# Altium schematic sheet lower-pcb.SchDoc
size A; SheetNumber: 1; SheetTotal: 1
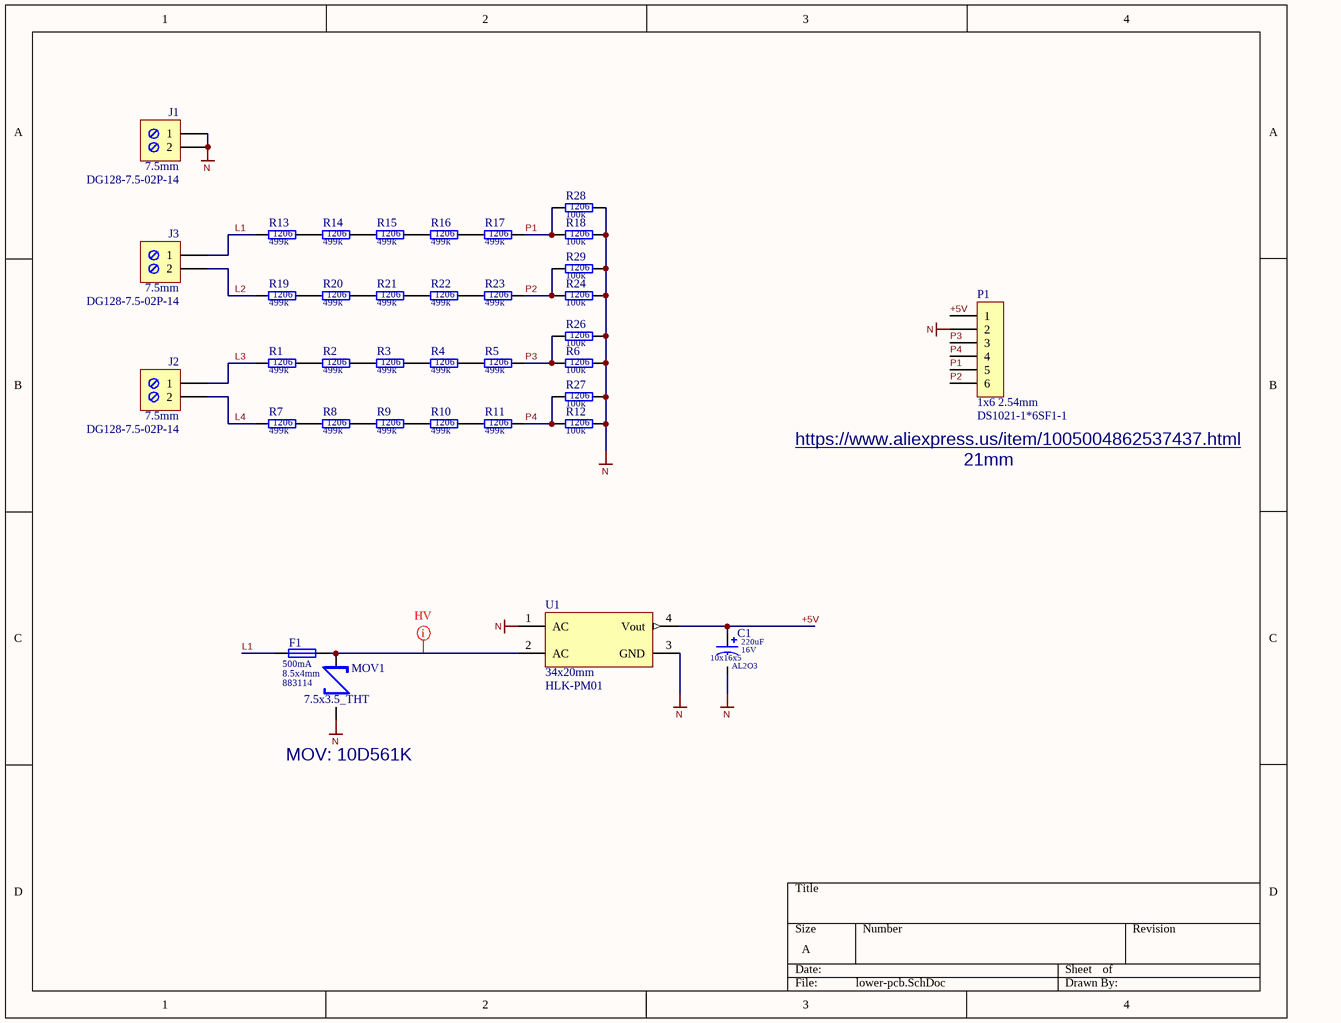
[diagram p0: lower-pcb.SchDoc]

## Parts
C1  value 220uF  Dielectric: AL2O3  SCH_Footprint: 10x16x5  Voltage: 16V  [CE_D_10x16x5_THT]  (hidden comment: Electrolytic Capacitor)
F1  value 883114  SCH_Footprint: 8.5x4mm  Current: 500mA  [F_TE5_8.5x4]  (hidden comment: Fuse)
J1  value DG128-7.5-02P-14  SCH_Footprint: 7.5mm  [DG128-7.5-02P-14]  (hidden comment: Terminal Blocks 2P 7.5mm)
J2  value DG128-7.5-02P-14  SCH_Footprint: 7.5mm  [DG128-7.5-02P-14]  (hidden comment: Terminal Blocks 2P 7.5mm)
J3  value DG128-7.5-02P-14  SCH_Footprint: 7.5mm  [DG128-7.5-02P-14]  (hidden comment: Terminal Blocks 2P 7.5mm)
MOV1  MOV  [MOV_AXIAL_7.5_3.5]  (value not drawn)
P1  value DS1021-1*6SF1-1  SCH_Footprint: 1x6 2.54mm  [P_HEADER_1x6_2.54]  (hidden comment: Goldpin)
R1  value 499k  SCH_Footprint: 1206  [R_1206_3216]  (hidden comment: Resistor)
R2  value 499k  SCH_Footprint: 1206  [R_1206_3216]  (hidden comment: Resistor)
R3  value 499k  SCH_Footprint: 1206  [R_1206_3216]  (hidden comment: Resistor)
R4  value 499k  SCH_Footprint: 1206  [R_1206_3216]  (hidden comment: Resistor)
R5  value 499k  SCH_Footprint: 1206  [R_1206_3216]  (hidden comment: Resistor)
R6  value 100k  SCH_Footprint: 1206  [R_1206_3216]  (hidden comment: Resistor)
R7  value 499k  SCH_Footprint: 1206  [R_1206_3216]  (hidden comment: Resistor)
R8  value 499k  SCH_Footprint: 1206  [R_1206_3216]  (hidden comment: Resistor)
R9  value 499k  SCH_Footprint: 1206  [R_1206_3216]  (hidden comment: Resistor)
R10  value 499k  SCH_Footprint: 1206  [R_1206_3216]  (hidden comment: Resistor)
R11  value 499k  SCH_Footprint: 1206  [R_1206_3216]  (hidden comment: Resistor)
R12  value 100k  SCH_Footprint: 1206  [R_1206_3216]  (hidden comment: Resistor)
R13  value 499k  SCH_Footprint: 1206  [R_1206_3216]  (hidden comment: Resistor)
R14  value 499k  SCH_Footprint: 1206  [R_1206_3216]  (hidden comment: Resistor)
R15  value 499k  SCH_Footprint: 1206  [R_1206_3216]  (hidden comment: Resistor)
R16  value 499k  SCH_Footprint: 1206  [R_1206_3216]  (hidden comment: Resistor)
R17  value 499k  SCH_Footprint: 1206  [R_1206_3216]  (hidden comment: Resistor)
R18  value 100k  SCH_Footprint: 1206  [R_1206_3216]  (hidden comment: Resistor)
R19  value 499k  SCH_Footprint: 1206  [R_1206_3216]  (hidden comment: Resistor)
R20  value 499k  SCH_Footprint: 1206  [R_1206_3216]  (hidden comment: Resistor)
R21  value 499k  SCH_Footprint: 1206  [R_1206_3216]  (hidden comment: Resistor)
R22  value 499k  SCH_Footprint: 1206  [R_1206_3216]  (hidden comment: Resistor)
R23  value 499k  SCH_Footprint: 1206  [R_1206_3216]  (hidden comment: Resistor)
R24  value 100k  SCH_Footprint: 1206  [R_1206_3216]  (hidden comment: Resistor)
R26  value 100k  SCH_Footprint: 1206  [R_1206_3216]  (hidden comment: Resistor)
R27  value 100k  SCH_Footprint: 1206  [R_1206_3216]  (hidden comment: Resistor)
R28  value 100k  SCH_Footprint: 1206  [R_1206_3216]  (hidden comment: Resistor)
R29  value 100k  SCH_Footprint: 1206  [R_1206_3216]  (hidden comment: Resistor)
U1  value HLK-PM01  SCH_Footprint: 34x20mm  [VS_HLK-PMxx]  (hidden comment: 5V Mains power supply)

## Nets
N: C1.2 J1.1 J1.2 MOV1.1 P1.2 R6.2 R12.2 R18.2 R24.2 R26.2 R27.2 R28.2 R29.2 U1.1(AC) U1.3(GND)
+5V: C1.1 P1.1 U1.4(Vout)
L1: F1.1 J3.1 R13.1
L2: J3.2 R19.1
L3: J2.1 R1.1
L4: J2.2 R7.1
P1: P1.5 R17.2 R18.1 R28.1
P2: P1.6 R23.2 R24.1 R29.1
P3: P1.3 R5.2 R6.1 R26.1
P4: P1.4 R11.2 R12.1 R27.1
NetF1_2: F1.2 MOV1.2 U1.2(AC)
NetR1_2: R1.2 R2.1
NetR2_2: R2.2 R3.1
NetR3_2: R3.2 R4.1
NetR4_2: R4.2 R5.1
NetR7_2: R7.2 R8.1
NetR8_2: R8.2 R9.1
NetR9_2: R9.2 R10.1
NetR10_2: R10.2 R11.1
NetR13_2: R13.2 R14.1
NetR14_2: R14.2 R15.1
NetR15_2: R15.2 R16.1
NetR16_2: R16.2 R17.1
NetR19_2: R19.2 R20.1
NetR20_2: R20.2 R21.1
NetR21_2: R21.2 R22.1
NetR22_2: R22.2 R23.1

## Layout directives
net class HV: NetF1_2

## Notes on the sheet
- (near P1) https://www.aliexpress.us/item/1005004862537437.html
- 21mm
- (near MOV1) MOV: 10D561K

## Library data of the parts
C1 = CE_680uF_16V_AL2O3_10x16x5_20: Polarized Capacitor; Manufacturer: Panasonic; Manufacturer Part Number: EEU-FC1C681; Tolerance (%): 20; Part Number: CE_680uF_16V_AL2O3_10x16x5_20; HelpURL: https://datasheet.octopart.com/EEU-FC1C681-Panasonic-datasheet-5313828.pdf; Supplier 1: TME; Supplier Part Number 1: EEUFC1C681; Supplier 2: RS Components; Supplier Part Number 2: 572176; Supplier 3: Farnell; Supplier Part Number 3: 2326274; Supplier 4: Mouser; Supplier Part Number 4: 667-EEU-FC1C681; Supplier 5: Digi-Key; Supplier Part Number 5: P10250-ND; Supplier 6: LCSC
F1 = F_500mA_250V_TE5_8.5x4: Manufacturer: ESKA; Voltage: 250V; Part Number: F_500mA_250V_TE5_8.5x4; HelpURL: https://www.tme.eu/Document/a40ea296602c4335b0d3d6f44eb25624/883.100_2019_01.pdf; Manufacturer Part Number: 883114; Supplier 1: TME; Supplier Part Number 1: 883114; Supplier 2: RS Components; Supplier 3: Farnell; Supplier 4: Mouser; Supplier 5: Digi-Key; Supplier 6: LCSC
J1-J3 = J_DG128-7.5-02P-14: ARK Screw terminal, 2-Pin; Manufacturer: DEGSON ELECTRONICS; Part Number: J_DG128-7.5-02P-14; HelpURL: https://www.tme.eu/Document/265c0002552eeae045ca30ec463f477a/DG128-7.5.pdf; Manufacturer Part Number: DG128-7.5-02P-14; Supplier 1: TME; Supplier 2: RS Components; Supplier 3: Farnell; Supplier 4: Mouser; Supplier 5: Digi-Key; Supplier 6: LCSC; Supplier Part Number 1: DG128-7.5-02P14
MOV1 = MOV_385VDC_300VAC_THT: Varistor; Manufacturer: Epcos; Voltage: 385VDC/300VAC; SCH_Footprint: 7.5x3.5_THT; Value: B72214P2301K103; Part Number: MOV_385VDC_300VAC_THT; HelpURL: https://product.tdk.com/en/system/files?file=dam/doc/product/protection/voltage/lead-disk-varistor/data_sheet/70/db/var/siov_leaded_advanced_mp_s14_compact_series.pdf; Manufacturer Part Number: B72214P2301K103; Supplier 1: TME; Supplier 2: RS Components; Supplier 3: Farnell; Supplier Part Number 3: 3359824; Supplier 4: Mouser; Supplier Part Number 4: 871-B72214P2301K103; Supplier 5: Digi-Key; Supplier Part Number 5: 495-B72214P2301K103-ND; Supplier 6: LCSC
P1 = P_HEADER_1x6_2.54: Pin Header; Manufacturer: Connfly; Part Number: P_HEADER_1x6_2.54; HelpURL: http://www.tme.eu/en/Document/cc301e58a5da78cb543a94b5a5b7f06a/DS1021.pdf; Manufacturer Part Number: DS1021-1*6SF1-1; Supplier 1: TME; Supplier Part Number 1: ZL201-06G; Supplier 2: RS Components; Supplier 3: Farnell; Supplier 4: Mouser; Supplier 5: Digi-Key; Supplier 6: LCSC
R1-R5 R7-R11 R13-R17 R19-R23 = R_499k_1206_1: Manufacturer: Yageo; Manufacturer Part Number: RC1206FR-07499KL; Voltage: 200V; Power: 250mW; Tolerance: 1%; Part Number: R_499k_1206_1; HelpURL: https://www.tme.eu/Document/2f2597e8e9126be8f2c43440d3744b92/rc1206yageo.pdf; Supplier 1: TME; Supplier Part Number 1: RC1206FR-07499KL; Supplier 2: RS Components; Supplier 3: Farnell; Supplier 4: Mouser; Supplier Part Number 4: 603-RC1206FR-07499KL; Supplier 5: Digi-Key; Supplier Part Number 5: 311-499KFRCT-ND; Supplier 6: LCSC
R6 R12 R18 R24 R26-R29 = R_100k_1206_1: Manufacturer: Yageo; Manufacturer Part Number: RC1206FR-07100KL; Voltage: 200V; Power: 250mW; Tolerance: 1%; Part Number: R_100k_1206_1; HelpURL: https://www.tme.eu/pl/Document/2f2597e8e9126be8f2c43440d3744b92/rc1206yageo.pdf; Supplier 1: TME; Supplier Part Number 1: RC1206FR-07100K; Supplier 2: RS Components; Supplier 3: Farnell; Supplier Part Number 3: 2693771; Supplier 4: Mouser; Supplier Part Number 4: 603-RC1206FR-07100KL; Supplier 5: Digi-Key; Supplier Part Number 5: 311-100KFRDKR-ND; Supplier 6: LCSC
U1 = VS_HLK-PM01: Manufacturer: Hi-Link; Frequency (kHz): 0; Topology: Other; Vin min (V): 90; Vin max (V): 245; Vout min (V): 4.8; Vout max (V): 5.2; Imax (A): 0.6; Part Number: VS_HLK-PM01; HelpURL: https://datasheet.lcsc.com/szlcsc/1909111105_HI-LINK-HLK-PM24_C399250.pdf; Manufacturer Part Number: HLK-PM01; Supplier 1: TME; Supplier 2: RS Components; Supplier 3: Farnell; Supplier 4: Mouser; Supplier 5: Digi-Key; Supplier 6: LCSC; Supplier Part Number 6: C209903; Supplier 7: Botland; Supplier Part Number 7: DNG-10929; Iswitch (A): 0